# EAGLE design midi_block_R2_0 (EAGLE 6.6.0)
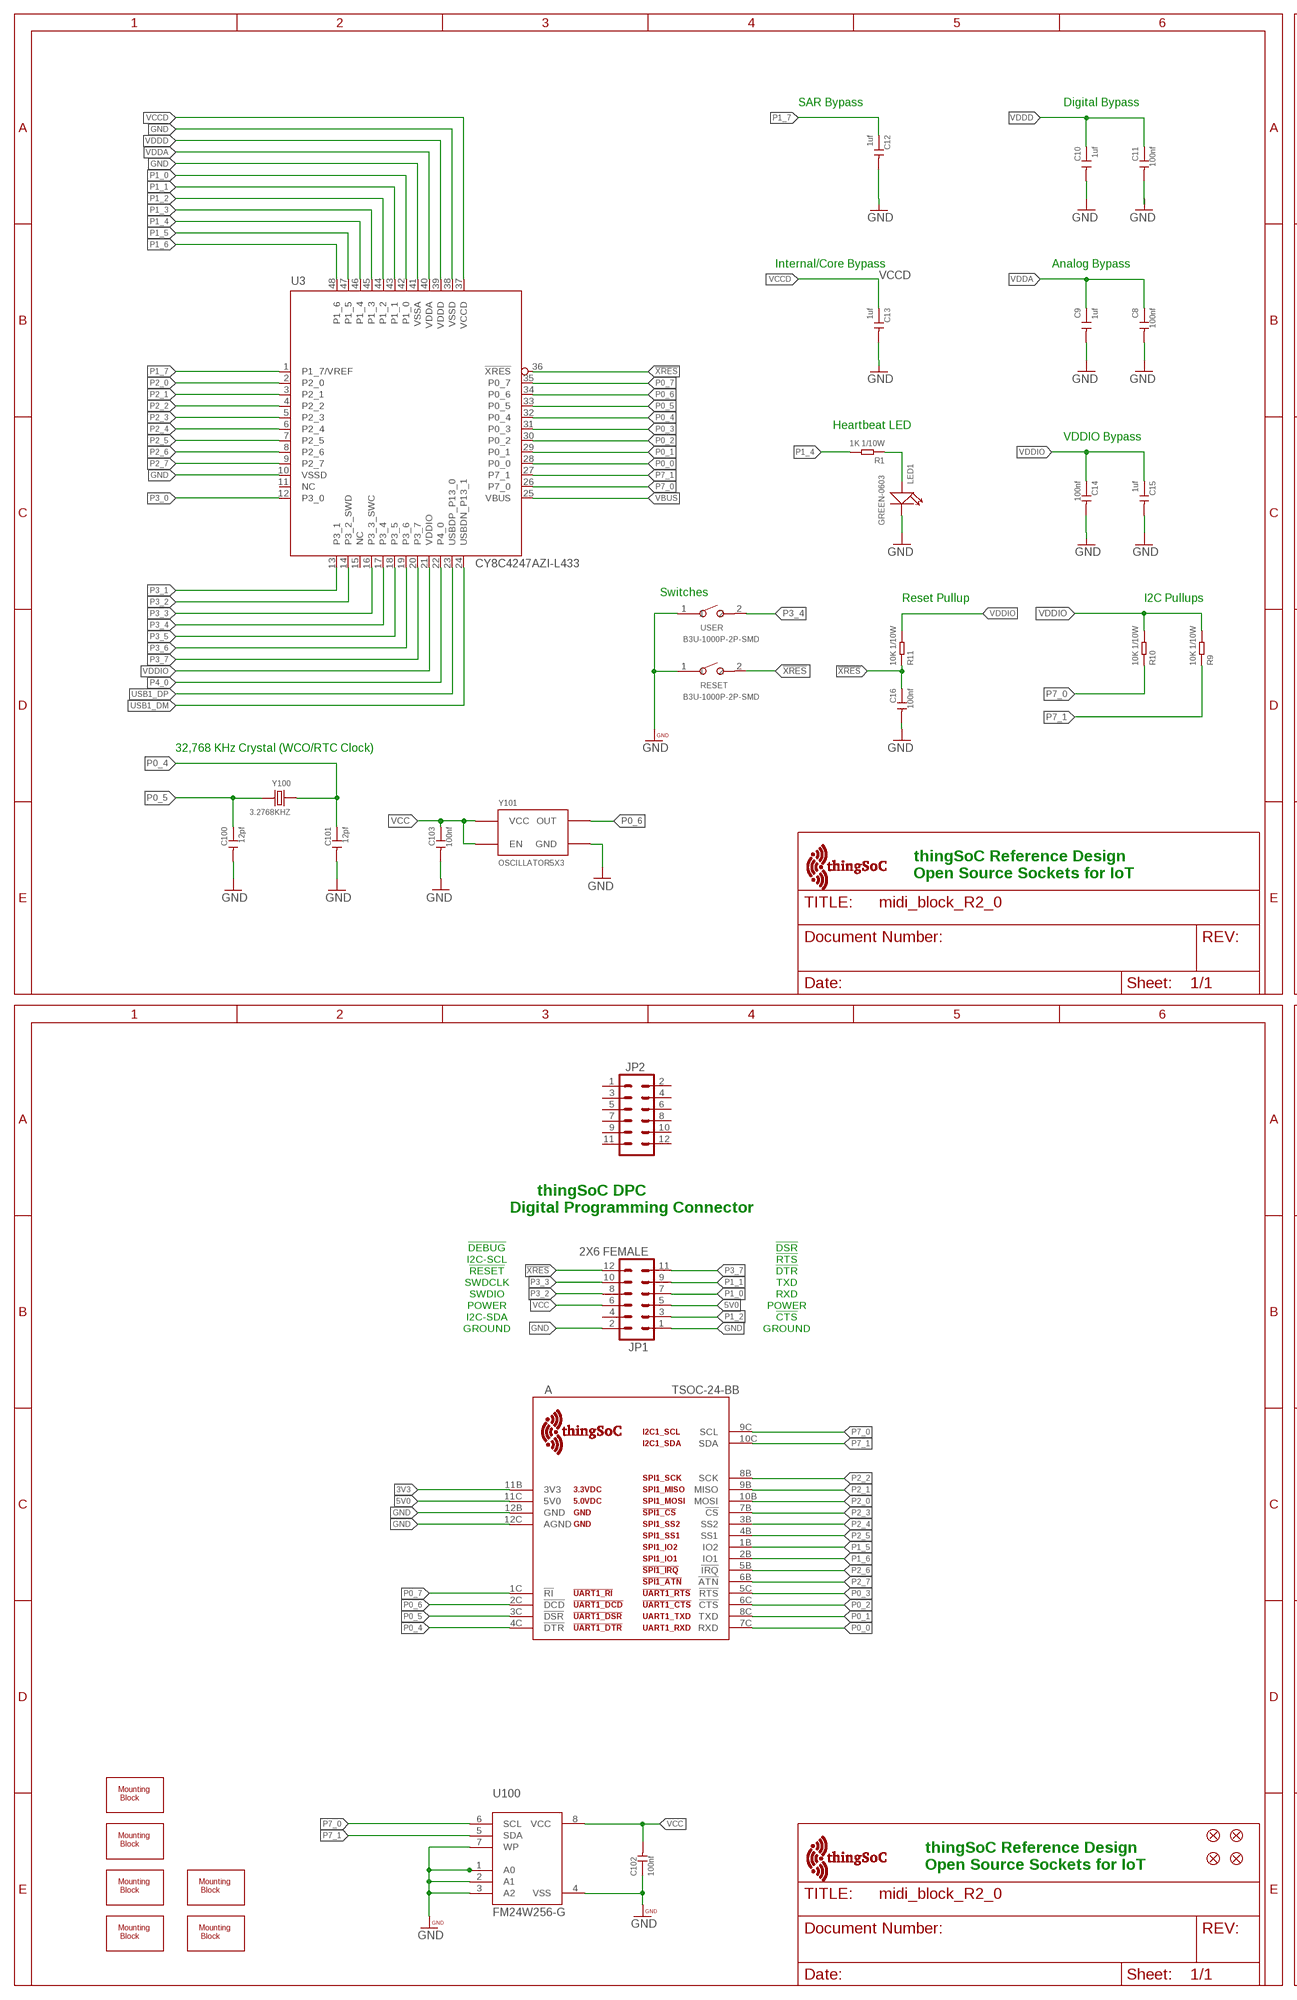
[diagram p0: schematic, sheet 1, part 1 of 2]
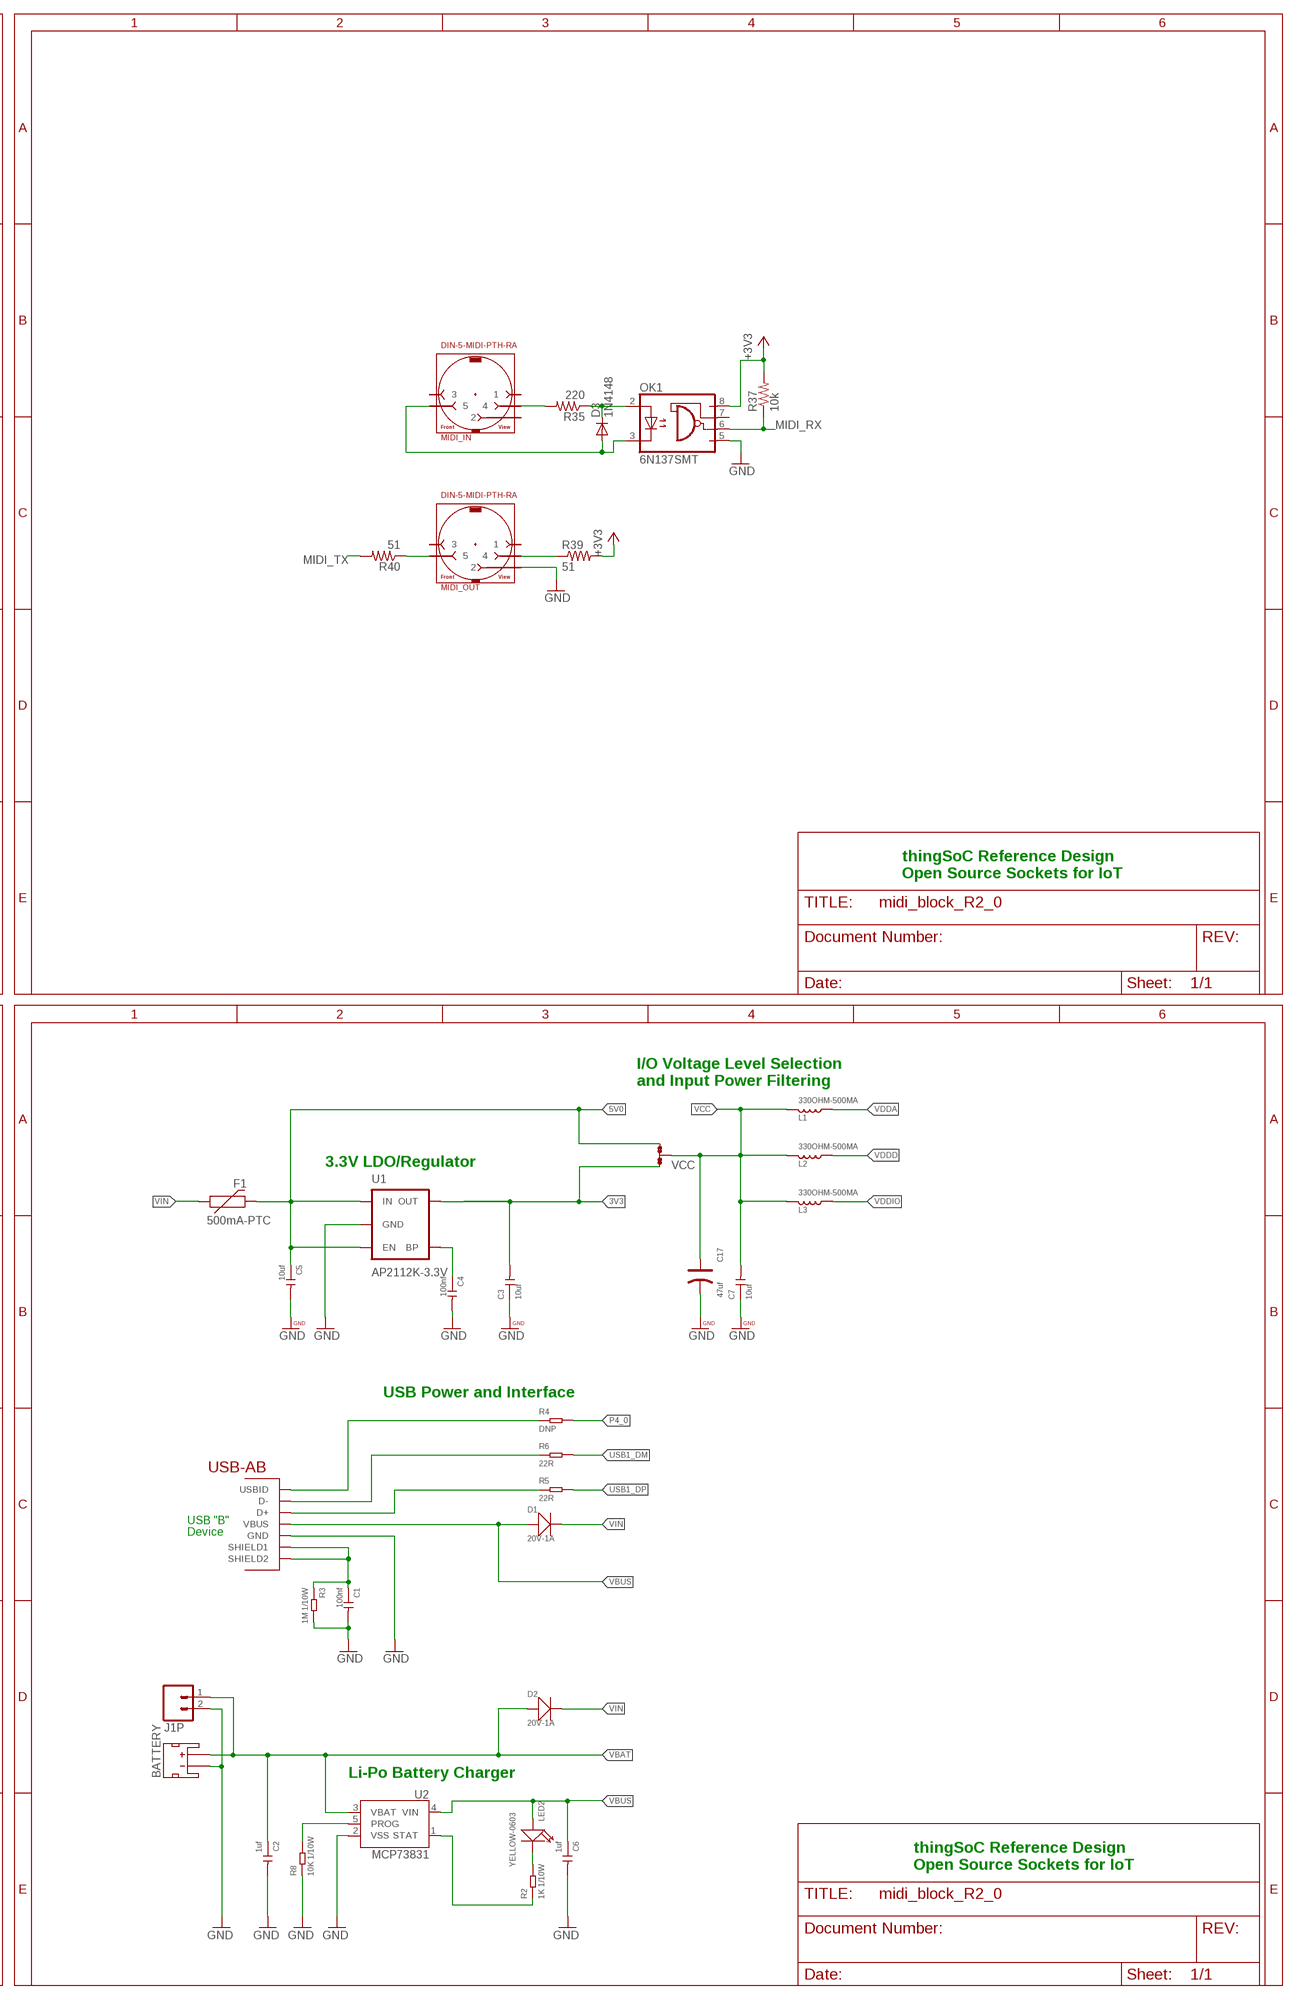
[diagram p1: schematic, sheet 1, part 2 of 2]

## Parts
A  TSOC-24-BB  [TSOC-BB-S24]
BATTERY  JST_2MM_MALE  [JST-2-SMD]
C1  100nf  CERAMIC-100NF-50V-10%-X7R(0603)  [C0603]
C2  1uf  CERAMIC-1UF-25V-10%-X7R(0603)  [C0603]
C3  10uf  CERAMIC-10UF-10V-10%-X5R(0603)  [C0603]
C4  100nf  CERAMIC-100NF-50V-10%-X7R(0603)  [C0603]
C5  10uf  CERAMIC-10UF-10V-10%-X5R(0603)  [C0603]
C6  1uf  CERAMIC-1UF-25V-10%-X7R(0603)  [C0603]
C7  10uf  CERAMIC-10UF-10V-10%-X5R(0603)  [C0603]
C8  100nf  CERAMIC-100NF-50V-10%-X7R(0603)  [C0603]
C9  1uf  CERAMIC-1UF-25V-10%-X7R(0603)  [C0603]
C10  1uf  CERAMIC-1UF-25V-10%-X7R(0603)  [C0603]
C11  100nf  CERAMIC-100NF-50V-10%-X7R(0603)  [C0603]
C12  1uf  CERAMIC-1UF-25V-10%-X7R(0603)  [C0603]
C13  1uf  CERAMIC-1UF-25V-10%-X7R(0603)  [C0603]
C14  100nf  CERAMIC-100NF-50V-10%-X7R(0603)  [C0603]
C15  1uf  CERAMIC-1UF-25V-10%-X7R(0603)  [C0603]
C16  100nf  CERAMIC-100NF-50V-10%-X7R(0603)  [C0603]
C17  47uf  TANTALUM-SMD-47UF-6.3V(AVX-A)  [AVX-A]
C100  12pf  CERAMIC-12PF-50V-5%-NPO(0603)  [C0603]
C101  12pf  CERAMIC-12PF-50V-5%-NPO(0603)  [C0603]
C102  100nf  CERAMIC-100NF-50V-10%-X7R(0603)  [C0603]
C103  100nf  CERAMIC-100NF-50V-10%-X7R(0603)  [C0603]
D1  20V-1A  SMD-DIODE-SCHOTTKY-20V-1A(SOD-123)  [SOD-123]
D2  20V-1A  SMD-DIODE-SCHOTTKY-20V-1A(SOD-123)  [SOD-123]
D3  1N4148  DIODE-SOD323-W  [SOD323-W]
F1  500mA-PTC  PTCSMD  [PTC-1206]
FID1  FIDUCIALUFIDUCIAL  [MICRO-FIDUCIAL]
FID2  FIDUCIALUFIDUCIAL  [MICRO-FIDUCIAL]
FID3  FIDUCIALUFIDUCIAL  [MICRO-FIDUCIAL]
FID4  FIDUCIALUFIDUCIAL  [MICRO-FIDUCIAL]
J1P  M02-JST-2-PTH-NO_SILK  [JST-2-PTH-NS]
JP1  2X6 FEMALE  M06X2PTH_FEMALE  [2X6]
JP2  M06X2FEMALE-SMT  [2X6_SMD]
L1  330OHM-500MA  SMD-FERRITE-CHIP-120-OHM-500MA(0603)  [L0603]
L2  330OHM-500MA  SMD-FERRITE-CHIP-120-OHM-500MA(0603)  [L0603]
L3  330OHM-500MA  SMD-FERRITE-CHIP-120-OHM-500MA(0603)  [L0603]
LED1  GREEN-0603  SMD-LED-CLEAR-GREEN(0603)  [LED-0603]
LED2  YELLOW-0603  SMD-LED-CLEAR-YELLOW(0603)  [LED-0603]
MIDI_IN  DIN-5-MIDI-PTH-RA  [DIN-5-PTH-RA-SUPPORT]
MIDI_OUT  DIN-5-MIDI-PTH-RA  [DIN-5-PTH-RA-SUPPORT]
OK1  6N137SMT  [DIL8-SMD]
R1  1K 1/10W  SMD-RES-1K-5%-1/10W(0603)  [R0603]
R2  1K 1/10W  SMD-RES-1K-5%-1/10W(0603)  [R0603]
R3  1M 1/10W  SMD-RES-1M-5%-1/10W(0603)  [R0603]
R4  DNP  SMD-RES-22R-5%-1/10W(0603)  [R0603]
R5  22R  SMD-RES-22R-5%-1/10W(0603)  [R0603]
R6  22R  SMD-RES-22R-5%-1/10W(0603)  [R0603]
R8  10K 1/10W  SMD-RES-10K-5%-1/10W(0603)  [R0603]
R9  10K 1/10W  SMD-RES-10K-5%-1/10W(0603)  [R0603]
R10  10K 1/10W  SMD-RES-10K-5%-1/10W(0603)  [R0603]
R11  10K 1/10W  SMD-RES-10K-5%-1/10W(0603)  [R0603]
R35  220  R-US_R0603  [R0603]
R37  10k  R-US_R0603  [R0603]
R39  51  R-US_R0603  [R0603]
R40  51  R-US_R0603  [R0603]
RESET  B3U-1000P-2P-SMD  SMD-BUTTON(2P-3.0X2.5X1.2+0.4MM)-B3U-1000P-2P-SMD  [SW2-2.6-3.0X2.5X1.2+0.4MM]
U1  AP2112K-3.3V  V_REG_LDOSMD  [SOT23-5]
U2  MCP73831  [SOT23-5]
U3  CY8C4247AZI-L433  [TQFP-7X7-48]
U100  FM24W256-G  [SO08]
U$1  PCB-MB-SIDE  [PCB-MB-01-SIDE]
U$7  PCB-MB-SIDE  [PCB-MB-01-SIDE]
U$8  PCB-MB-SIDE  [PCB-MB-01-SIDE]
U$9  PCB-MB-SIDE  [PCB-MB-01-SIDE]
U$10  PCB-MB-SIDE  [PCB-MB-01-SIDE]
U$11  PCB-MB-SIDE  [PCB-MB-01-SIDE]
U$100  TSOC-LOGO-LRG  [TSOC-LOGO-LRG]
U$101  TSOC-LOGO-SMALL  [TSOC-LOGO-SML]
USB  USB_AB  [USB-AB-MICRO-SMD]
USER  B3U-1000P-2P-SMD  SMD-BUTTON(2P-3.0X2.5X1.2+0.4MM)-B3U-1000P-2P-SMD  [SW2-2.6-3.0X2.5X1.2+0.4MM]
VCC  JMP-3-1_2  [JMP-3-1_2]
Y100  3.2768KHZ  SMD-CRYSTAL-32.768KHZ-12.5PF-20PPM-90K(2P-L2.0X1.2MM)  [X2-SMD-L2.0X1.2X0.55MM]
Y101  OSCILLATOR5X3  [CRYSTAL-SMD-5X3]

## Nets
3V3: A.11B(3V3) C3.2 U1.5(OUT) VCC.1
5V0: A.11C(5V0) C5.1 F1.2 JP1.5 U1.1(IN) U1.3(EN) VCC.3
!XRES: C16.1 JP1.12 R11.1 RESET.2 U3.36(!XRES)
+3V3: OK1.8(VCC) R37.2 R39.2
BYPASS1: C4.1 U1.4(BP)
CLED: LED2.- R2.2
CSTAT: R2.1 U2.1(STAT)
GND: A.12B(GND) A.12C(AGND) BATTERY.1(-) C1.2 C2.2 C3.1 C4.2 C5.2 C6.2 C7.1 C8.2 C9.2 C10.2 C11.2 C12.2 C13.2 C14.2 C15.2 C16.2 C17.- C100.2 C101.2 C102.1 C103.2 J1P.2 JP1.1 JP1.2 LED1.- MIDI_OUT.2 OK1.5(GND) R3.2 R8.1 RESET.1 U1.2(GND) U2.2(VSS) U3.10(VSSD) U3.38(VSSD) U3.41(VSSA) U100.1(A0) U100.2(A1) U100.3(A2) U100.4(VSS) U100.7(WP) USB.GND USER.1 Y101.2(GND)
MIDI_RX: OK1.6(VO) R37.1
MIDI_TX: R40.2
N$1: R8.2 U2.5(PROG)
N$8: D3.C OK1.2(A) R35.1
N$9: MIDI_IN.4 R35.2
N$10: MIDI_OUT.5 R40.1
N$12: D3.A MIDI_IN.5 OK1.3(C)
N$13: MIDI_OUT.4 R39.1
N$17: LED1.+ R1.1
P0_0: A.7C(RXD) U3.28(P0_0)
P0_1: A.8C(TXD) U3.29(P0_1)
P0_2: A.6C(!CTS) U3.30(P0_2)
P0_3: A.5C(!RTS) U3.31(P0_3)
P0_4: A.4C(!DTR) C101.1 U3.32(P0_4) Y100.1
P0_5: A.3C(!DSR) C100.1 U3.33(P0_5) Y100.2
P0_6: A.2C(!DCD) U3.34(P0_6) Y101.3(OUT)
P0_7: A.1C(!RI) U3.35(P0_7)
P1_0: JP1.7 U3.42(P1_0)
P1_1: JP1.9 U3.43(P1_1)
P1_2: JP1.3 U3.44(P1_2)
P1_3: U3.45(P1_3)
P1_4: R1.2 U3.46(P1_4)
P1_5: A.1B(IO2) U3.47(P1_5)
P1_6: A.2B(IO1) U3.48(P1_6)
P1_7: C12.1 U3.1(P1_7/VREF)
P2_0: A.10B(MOSI) U3.2(P2_0)
P2_1: A.9B(MISO) U3.3(P2_1)
P2_2: A.8B(SCK) U3.4(P2_2)
P2_3: A.7B(!CS) U3.5(P2_3)
P2_4: A.3B(SS2) U3.6(P2_4)
P2_5: A.4B(SS1) U3.7(P2_5)
P2_6: A.5B(!IRQ) U3.8(P2_6)
P2_7: A.6B(!ATN) U3.9(P2_7)
P3_0: U3.12(P3_0)
P3_1: U3.13(P3_1)
P3_2: JP1.8 U3.14(P3_2_SWD)
P3_3: JP1.10 U3.16(P3_3_SWC)
P3_4: U3.17(P3_4) USER.2
P3_5: U3.18(P3_5)
P3_6: U3.19(P3_6)
P3_7: JP1.11 U3.20(P3_7)
P4_0: R4.2 U3.22(P4_0)
P7_0: A.9C(SCL) R10.1 U3.26(P7_0) U100.6(SCL)
P7_1: A.10C(SDA) R9.1 U3.27(P7_1) U100.5(SDA)
USB1_DM: R6.2 U3.24(USBDN_P13_1)
USB1_DP: R5.2 U3.23(USBDP_P13_0)
USB1_I: R4.1 USB.ID(USBID)
USB1_M: R6.1 USB.D-
USB1_P: R5.1 USB.D+
USB1_SHIELD: C1.1 R3.1 USB.SHIELD1 USB.SHIELD2
VBAT: BATTERY.2(+) C2.1 D2.+ J1P.1 U2.3(VBAT)
VBUS: C6.1 D1.+ LED2.+ U2.4(VIN) U3.25(VBUS) USB.VBUS
VCC: C7.2 C17.+ C102.2 C103.1 JP1.6 L1.1 L2.1 L3.1 U100.8(VCC) VCC.2 Y101.1(EN) Y101.4(VCC)
VCCD: C13.1 U3.37(VCCD)
VDDA: C8.1 C9.1 L1.2 U3.40(VDDA)
VDDD: C10.1 C11.1 L2.2 U3.39(VDDD)
VDDIO: C14.1 C15.1 L3.2 R9.2 R10.2 R11.2 U3.21(VDDIO)
VIN: D1.- D2.- F1.1
Unconnected: BATTERY.NC1(PAD1) BATTERY.NC2(PAD2) JP1.4 JP2.1 JP2.2 JP2.3 JP2.4 JP2.5 JP2.6 JP2.7 JP2.8 JP2.9 JP2.10 JP2.11 JP2.12 MIDI_IN.1 MIDI_IN.2 MIDI_IN.3 MIDI_OUT.1 MIDI_OUT.3 OK1.7(VE) U3.11(NC) U3.15(NC)

## Notes on the sheet
- SAR Bypass | Digital Bypass
- Internal/Core Bypass | Analog Bypass
- Heartbeat LED
- VDDIO Bypass
- Switches
- Reset Pullup | I2C Pullups
- 32,768 KHz Crystal (WCO/RTC Clock)
- thingSoC Reference Design
  Open Source Sockets for IoT
- thingSoC Reference Design
  Open Source Sockets for IoT
- I/O Voltage Level Selection
  and Input Power Filtering
- 3.3V LDO/Regulator
- thingSoC DPC
  Digital Programming Connector
- !DEBUG | !DSR
- I2C-SCL | !RTS
- !RESET | !DTR
- SWDCLK | TXD
- SWDIO | RXD
- POWER | POWER
- I2C-SDA | !CTS
- GROUND | GROUND
- USB Power and Interface
- USB "B"
- Device
- Li-Po Battery Charger
- thingSoC Reference Design
  Open Source Sockets for IoT
- thingSoC Reference Design
  Open Source Sockets for IoT

## Library data of the parts
A = thingSoC:TSOC-24: thingSoC Twenty-Four(24) Pin Socket Source LBR : http://www.thingsoc.com Github : https://github.com/thingsoc License : http://creativecommons.org/licenses/by-sa/4.0/ (Creative Commons 4.0) THIS SOFTWARE IS PROVIDED BY THE CONTRIBUTORS "AS IS" AND WITHOUT ANY EXPRESS OR IMPLIED WARRANTIES, INCLUDING, BUT NOT LIMITED TO, THE IMPLIED WARRANTIES OF MERCHANTABILITY AND FITNESS FOR A PARTICULAR PURPOSE ARE DISCLAIMED. IN NO EVENT SHALL THE COPYRIGHT OWNER OR CONTRIBUTORS BE LIABLE FOR ANY DIRECT, INDIRECT, INCIDENTAL, SPECIAL, EXEMPLARY, OR CONSEQUENTIAL DAMAGES (INCLUDING, BUT NOT LIMITED TO, PROCUREMENT OF SUBSTITUTE GOODS OR SERVICES; LOSS OF USE, DATA, OR PROFITS; OR BUSINESS INTERRUPTION) HOWEVER CAUSED AND ON ANY THEORY OF LIABILITY, WHETHER IN CONTRACT, STRICT LIABILITY, OR TORT (INCLUDING NEGLIGENCE OR OTHERWISE) ARISING IN ANY WAY OUT OF THE USE OF THIS SOFTWARE, EVEN IF ADVISED OF THE POSSIBILITY OF SUCH DAMAGE.
BATTERY = TSOC-ESP8266-BASE:JST_2MM_MALE: Mates to single-cell LiPo batteries. CONN-11443 Now with smashable polarity marks!; BTM_NEG: -; BTM_POS: +; PROD_ID: CONN-11443; TOP_NEG: -; TOP_POS: +
C1 C4 C8 C11 C14 C16 C102 C103 = Seeed-Capacitor-2016:CERAMIC-100NF-50V-10%-X7R(0603): 302010138; MPN: CC0603KRX7R9BB104
C2 C6 C9 C10 C12 C13 C15 = Seeed-Capacitor-2016:CERAMIC-1UF-25V-10%-X7R(0603): 302010139; MPN: CC0603KRX7R8BB105
C3 C5 C7 = Seeed-Capacitor-2016:CERAMIC-10UF-10V-10%-X5R(0603): 302010103; MPN: CC0603KRX5R6BB106
C17 = Seeed-Capacitor-2016:TANTALUM-SMD-47UF-6.3V(AVX-A): 302020005; MPN: TAJA476*006#NJ
C100 C101 = Seeed-Capacitor-2016:CERAMIC-12PF-50V-5%-NPO(0603): 302010067; MPN: CC0603JRNPO9BN120
D1 D2 = Seeed-Diode-2016:SMD-DIODE-SCHOTTKY-20V-1A(SOD-123): 304020034; MPN: B5819W
D3 = diode:DIODE-: DIODE
F1 = SparkFun:PTC: Resettable Fuse PTC Resettable Fuse. Spark Fun Electronics SKU : COM-08357
FID1-FID4 = TSOC-ESP8266-BASE:FIDUCIAL: Fiducial Alignment Points Various fiducial points for machine vision alignment.
J1P = TSOC-ESP8266-BASE:M02: Standard 2-pin 0.1" header. Use with - straight break away headers ( PRT-00116) - right angle break away headers (PRT-00553) - swiss pins (PRT-00743) - machine pins (PRT-00117) - female headers (PRT-00115) Molex polarized connector foot print use with: PRT-08233 with associated crimp pins and housings. 2.54_SCREWTERM for use with PRT-10571. 3.5mm Screw Terminal footprints for PRT-08084 5mm Screw Terminal footprints for use with PRT-08432
JP1 = halcyonmod_Connectors:M06X2; PROD_ID: CONN-12423
JP2 = halcyonmod_Connectors:M06X2
L1-L3 = Seeed-Inductor-2016:SMD-FERRITE-CHIP-120-OHM-500MA(0603): 303030001; MPN: BLM18AG121SN1D; VALUE: 120OHM-500MA
LED1 = Seeed-LED-2016:SMD-LED-CLEAR-GREEN(0603): 304090043; MPN: 19-217-G7C-AN1P2-3T
LED2 = Seeed-LED-2016:SMD-LED-CLEAR-YELLOW(0603): 304090044; MPN: 19-217-Y5C-AM1N1VY-3T
MIDI_IN MIDI_OUT = oXo_connectors:DIN-5-MIDI: DIN-5 (MIDI) connector
OK1 = og-optocouplers:6N137: MOTOROLA OPTO COUPLER
R1 R2 = Seeed-Resistor-2016:SMD-RES-1K-5%-1/10W(0603): 301010291; MPN: RC0603JR-071KL
R3 = Seeed-Resistor-2016:SMD-RES-1M-5%-1/10W(0603): 301010100; MPN: RC0603JR-071ML
R4 = Seeed-Resistor-2016:SMD-RES-22R-5%-1/10W(0603): 301010289; MPN: RC0603JR-0722RL; VALUE: 22R
R5 R6 = Seeed-Resistor-2016:SMD-RES-22R-5%-1/10W(0603): 301010289; MPN: RC0603JR-0722RL
R8-R11 = Seeed-Resistor-2016:SMD-RES-10K-5%-1/10W(0603): 301010293; MPN: RC0603JR-0710KL
R35 R37 R39 R40 = rcl:R-US_: RESISTOR, American symbol
RESET USER = Seeed-Switch-2016:SMD-BUTTON(2P-3.0X2.5X1.2+0.4MM): 311020047; MPN: B3U-1000P-2P-SMD
U1 = SparkFun-PowerIC:V_REG_LDO: Voltage Regulator LDO Standard 150mA LDO voltage regulator in SOT-23 layout. Micrel part MIC5205. BP (by-pass) pin is used to lower output noise with 470pF cap.; PROD_ID: VREG-12457
U2 = TSOC-ESP8266-BASE:MCP73831: Miniature single cell, fully integrated Li-Ion, Li-polymer charge management controller http://ww1.microchip.com/downloads/en/DeviceDoc/20001984g.pdf IC-09995; PROD_ID: IC-09995
U3 = PatternAgents-Cypress:CY8C4247AZI-L433: Cypress PSoC® 4 - Programmable System on Chip, Cortex-M0 Based : USB Version! http://www.cypress.com/?mpn=CY8C4247AZI-L433 LBR Source: http://www.patternagents.com THIS SOFTWARE IS PROVIDED BY THE CONTRIBUTORS "AS IS" AND WITHOUT ANY EXPRESS OR IMPLIED WARRANTIES, INCLUDING, BUT NOT LIMITED TO, THE IMPLIED WARRANTIES OF MERCHANTABILITY AND FITNESS FOR A PARTICULAR PURPOSE ARE DISCLAIMED. IN NO EVENT SHALL THE COPYRIGHT OWNER OR CONTRIBUTORS BE LIABLE FOR ANY DIRECT, INDIRECT, INCIDENTAL, SPECIAL, EXEMPLARY, OR CONSEQUENTIAL DAMAGES (INCLUDING, BUT NOT LIMITED TO, PROCUREMENT OF SUBSTITUTE GOODS OR SERVICES; LOSS OF USE, DATA, OR PROFITS; OR BUSINESS INTERRUPTION) HOWEVER CAUSED AND ON ANY THEORY OF LIABILITY, WHETHER IN CONTRACT, STRICT LIABILITY, OR TORT (INCLUDING NEGLIGENCE OR OTHERWISE) ARISING IN ANY WAY OUT OF THE USE OF THIS SOFTWARE, EVEN IF ADVISED OF THE POSSIBILITY OF SUCH DAMAGE.
U100 = PatternAgents-Cypress:FM24W256: I2C FRAM FM24W256
U$1 U$7-U$11 = halcyonmod_Hardware:PCB-MB: Mounting Block Hardware Attaches two PCB's at a Right Angle using #4 Self-Threading Screws Source: http://www.essentracomponents.com.sg/images-line/pdfs/PCB-MB.pdf
U$100 U$101 = thingSoC:TSOC-LOGO: thingSoC Logo Source LBR : http://www.thingsoc.com Github : https://github.com/thingsoc License : http://creativecommons.org/licenses/by-sa/4.0/ (Creative Commons 4.0) THIS SOFTWARE IS PROVIDED BY THE CONTRIBUTORS "AS IS" AND WITHOUT ANY EXPRESS OR IMPLIED WARRANTIES, INCLUDING, BUT NOT LIMITED TO, THE IMPLIED WARRANTIES OF MERCHANTABILITY AND FITNESS FOR A PARTICULAR PURPOSE ARE DISCLAIMED. IN NO EVENT SHALL THE COPYRIGHT OWNER OR CONTRIBUTORS BE LIABLE FOR ANY DIRECT, INDIRECT, INCIDENTAL, SPECIAL, EXEMPLARY, OR CONSEQUENTIAL DAMAGES (INCLUDING, BUT NOT LIMITED TO, PROCUREMENT OF SUBSTITUTE GOODS OR SERVICES; LOSS OF USE, DATA, OR PROFITS; OR BUSINESS INTERRUPTION) HOWEVER CAUSED AND ON ANY THEORY OF LIABILITY, WHETHER IN CONTRACT, STRICT LIABILITY, OR TORT (INCLUDING NEGLIGENCE OR OTHERWISE) ARISING IN ANY WAY OUT OF THE USE OF THIS SOFTWARE, EVEN IF ADVISED OF THE POSSIBILITY OF SUCH DAMAGE.
USB = BeeSafe:USB_AB: This is a USB AB connector that is compatible with USB OTG. i.e. this connector can serve as a host or device
VCC = PatternAgents-ProtoPads:JMP-3-1_2: Three Terminal Jumper - 1 & 2 Connected Positions 1and 2 are normally connected. PatternAgents ProtoPads Library Schematic and PCB layout libraries for design patterns by PatternAgents. For the CADSoft Eagle CAD program : http://www.cadsoftusa.com/download-eagle/ Source LBR : http://www.patternagents.com Github : https://github.com/PatternAgents License : http://creativecommons.org/licenses/by-sa/4.0/ (Creative Commons 4.0) THIS SOFTWARE IS PROVIDED BY THE CONTRIBUTORS "AS IS" AND WITHOUT ANY EXPRESS OR IMPLIED WARRANTIES, INCLUDING, BUT NOT LIMITED TO, THE IMPLIED WARRANTIES OF MERCHANTABILITY AND FITNESS FOR A PARTICULAR PURPOSE ARE DISCLAIMED. IN NO EVENT SHALL THE COPYRIGHT OWNER OR CONTRIBUTORS BE LIABLE FOR ANY DIRECT, INDIRECT, INCIDENTAL, SPECIAL, EXEMPLARY, OR CONSEQUENTIAL DAMAGES (INCLUDING, BUT NOT LIMITED TO, PROCUREMENT OF SUBSTITUTE GOODS OR SERVICES; LOSS OF USE, DATA, OR PROFITS; OR BUSINESS INTERRUPTION) HOWEVER CAUSED AND ON ANY THEORY OF LIABILITY, WHETHER IN CONTRACT, STRICT LIABILITY, OR TORT (INCLUDING NEGLIGENCE OR OTHERWISE) ARISING IN ANY WAY OUT OF THE USE OF THIS SOFTWARE, EVEN IF ADVISED OF THE POSSIBILITY OF SUCH DAMAGE.; BOM: EXCLUDE
Y100 = Seeed-Crystal Oscillator-2016:SMD-CRYSTAL-32.768KHZ-12.5PF-20PPM-90K(2P-L2.0X1.2MM): 306010020; MPN: FC-12M
Y101 = SparkFun-FreqCtrl:OSCILLATOR: Generic 5x3 and 7x5 oscillators

## Net classes
1 vcc: width 0.254 mm

## Board
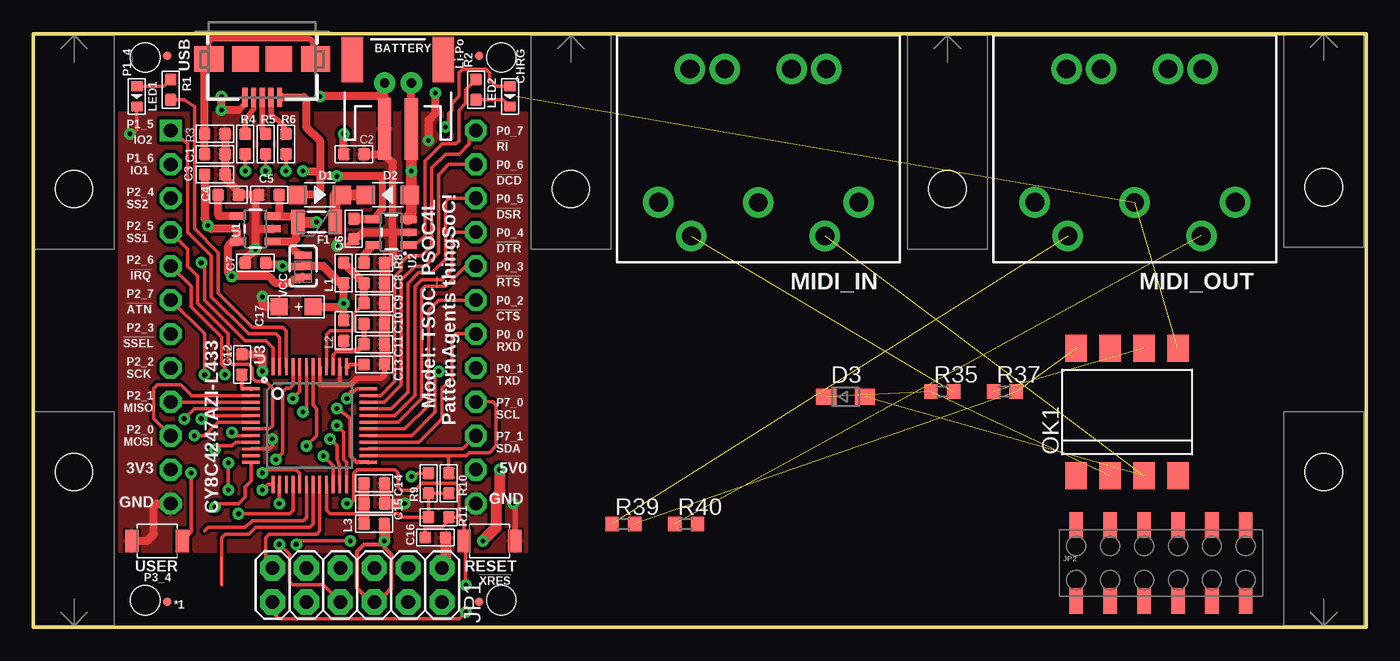
[diagram p2: board, top side]
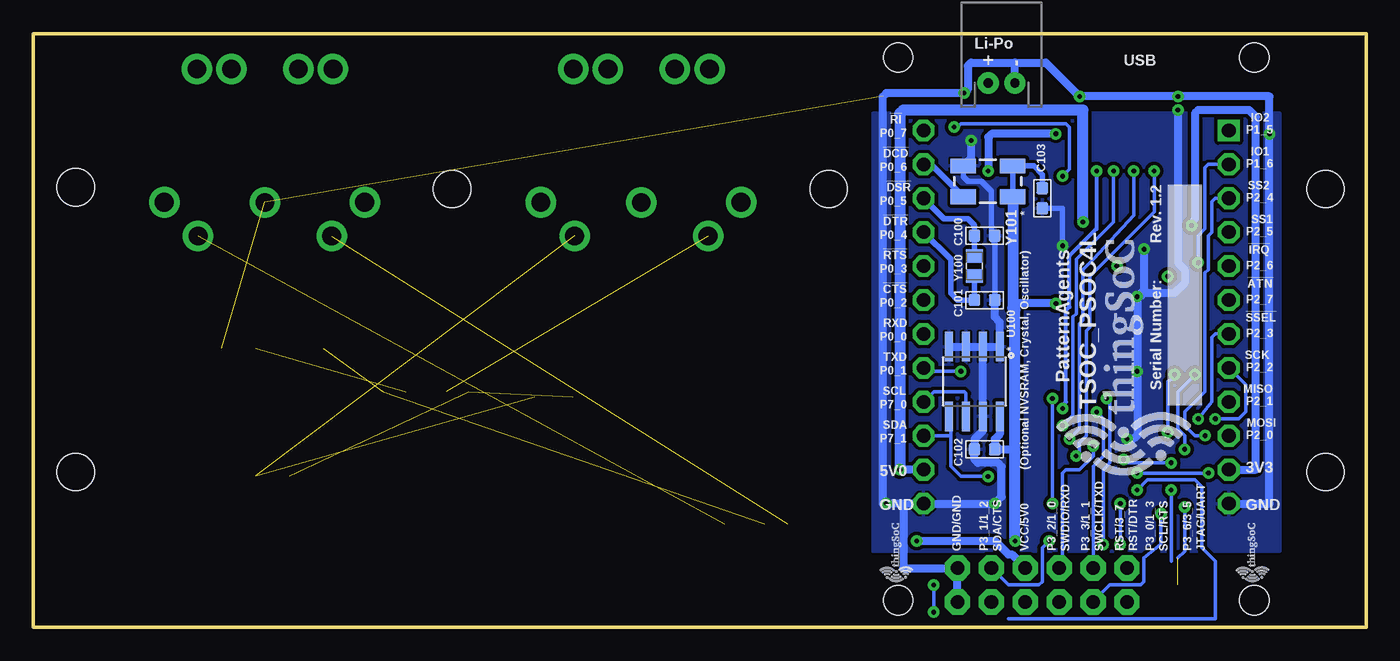
[diagram p3: board, bottom side, seen from below]

Size 99.82 x 44.45 mm. Coordinates in mm from the lower left corner, seen from the top.
Outline: 0,0 0,44.45 99.82,44.45 99.82,0 0,0
Copper layers (1*16): Top 0.035mm / dielectric 1.5mm / Bottom 0.035mm
Design rules "PatternAgents_7mil": minimum track width 7mil, minimum drill 14mil, track to track 7mil, track to pad 7mil, pad to pad 7mil, via to via 7mil, smd to smd 7mil, copper to edge 7mil, drill to drill 7mil, minimum pad ring 12mil, minimum via ring 10mil, stop-mask expansion 4mil, vias tented up to drill 25mil, thermal gap 7mil
Holes 2.2 mm at 8.38,2.03 35.05,2.03 35.05,42.67 8.38,42.67

### Footprints (pad centres in the part's own frame; a part is rotated, then mirrored left to right if it is on the bottom)
TSOC-BB-S24 = drill 1.016 square: 1B -11.43,11.43 | drill 1.016 octagon: 1C 11.43,11.43; 2B -11.43,8.89; 2C 11.43,8.89; 3B -11.43,6.35; 3C 11.43,6.35; 4B -11.43,3.81; 4C 11.43,3.81; 5B -11.43,1.27; 5C 11.43,1.27; 6B -11.43,-1.27; 6C 11.43,-1.27; 7B -11.43,-3.81; 7C 11.43,-3.81; 8B -11.43,-6.35; 8C 11.43,-6.35; 9B -11.43,-8.89; 9C 11.43,-8.89; 10B -11.43,-11.43; 10C 11.43,-11.43; 11B -11.43,-13.97; 11C 11.43,-13.97; 12B -11.43,-16.51; 12C 11.43,-16.51
JST-2-SMD = smd 1 x 4.6: 1 -1,-3.7; 2 1,-3.7 | smd 1.6 x 3.4: NC1 -3.4,1.5; NC2 3.4,1.5
C0603 = smd 0.889 x 0.889: 1 0,0.762; 2 0,-0.762
AVX-A = smd 1.27 x 1.27: + -1.27,0; - 1.27,0
SOD-123 = smd 1.397 x 1.397: + -1.651,0; - 1.651,0
SOD323-W = smd 1.5 x 1.2: A 1.45,0; C -1.45,0
PTC-1206 = smd 1 x 1.8: 1 -1.4,0; 2 1.4,0
MICRO-FIDUCIAL = smd 0.635 x 0.635: 1 0,0
JST-2-PTH-NS = drill 0.7 pad 1.6: 1 -1,0; 2 1,0
2X6 = drill 1.016 pad 1.88 octagon: 1 0,0; 2 0,2.54; 3 2.54,0; 4 2.54,2.54; 5 5.08,0; 6 5.08,2.54; 7 7.62,0; 8 7.62,2.54; 9 10.16,0; 10 10.16,2.54; 11 12.7,0; 12 12.7,2.54
2X6_SMD = smd 1.02 x 1.9: 1 -5.08,-2.85; 2 -5.08,2.85; 3 -2.54,-2.85; 4 -2.54,2.85; 5 0,-2.85; 6 0,2.85; 7 2.54,-2.85; 8 2.54,2.85; 9 5.08,-2.85; 10 5.08,2.85; 11 7.62,-2.85; 12 7.62,2.85
L0603 = smd 0.889 x 0.889: 1 -0.762,0; 2 0.762,0
LED-0603 = smd 0.762 x 0.889: + -0.762,0; - 0.762,0
DIN-5-PTH-RA-SUPPORT = drill 1.4 pad 2.286: 1 7.54,3.6; 2 0.06,3.61; 3 -7.47,3.6; 4 5.07,6.13; 5 -4.93,6.12; SR1 -5.03,-6.382; SR2 -2.43,-6.382; SR3 2.57,-6.382; SR4 5.178,-6.382
DIL8-SMD = smd 1.6 x 2: 1 -3.81,-4.77; 2 -1.27,-4.77; 3 1.27,-4.77; 4 3.81,-4.77; 5 3.81,4.77; 6 1.27,4.77; 7 -1.27,4.77; 8 -3.81,4.77
R0603 = smd 0.889 x 0.889: 1 0,0.762; 2 0,-0.762
R0603' = smd 1 x 1.1: 1 -0.85,0; 2 0.85,0
SW2-2.6-3.0X2.5X1.2+0.4MM = smd 1 x 1.7: 1 -1.9,0; 2 1.9,0
SOT23-5 = smd 0.55 x 1.2: 1 -0.95,-1.3; 2 0,-1.3; 3 0.95,-1.3; 4 0.95,1.3; 5 -0.95,1.3
TQFP-7X7-48 = smd 1.3 x 0.21: 1 -4.4,2.75; 2 -4.4,2.25; 3 -4.4,1.75; 4 -4.4,1.25; 5 -4.4,0.75; 6 -4.4,0.25; 7 -4.4,-0.25; 8 -4.4,-0.75; 9 -4.4,-1.25; 10 -4.4,-1.75; 11 -4.4,-2.25; 12 -4.4,-2.75; 25 4.4,-2.75; 26 4.4,-2.25; 27 4.4,-1.75; 28 4.4,-1.25; 29 4.4,-0.75; 30 4.4,-0.25; 31 4.4,0.25; 32 4.4,0.75; 33 4.4,1.25; 34 4.4,1.75; 35 4.4,2.25; 36 4.4,2.75 | smd 0.21 x 1.3: 13 -2.75,-4.4; 14 -2.25,-4.4; 15 -1.75,-4.4; 16 -1.25,-4.4; 17 -0.75,-4.4; 18 -0.25,-4.4; 19 0.25,-4.4; 20 0.75,-4.4; 21 1.25,-4.4; 22 1.75,-4.4; 23 2.25,-4.4; 24 2.75,-4.4; 37 2.75,4.4; 38 2.25,4.4; 39 1.75,4.4; 40 1.25,4.4; 41 0.75,4.4; 42 0.25,4.4; 43 -0.25,4.4; 44 -0.75,4.4; 45 -1.25,4.4; 46 -1.75,4.4; 47 -2.25,4.4; 48 -2.75,4.4
SO08 = smd 0.61 x 2.21: 1 -1.905,-2.616; 2 -0.635,-2.616; 3 0.635,-2.616; 4 1.905,-2.616; 5 1.905,2.616; 6 0.635,2.616; 7 -0.635,2.616; 8 -1.905,2.616
PCB-MB-01-SIDE = hole 2.8: 3.5,0
USB-AB-MICRO-SMD = smd 1.4 x 0.4: D+ 2.85,0; D- 2.85,0.65; GND 2.85,-1.3; ID 2.85,-0.65; VBUS 2.85,1.3 | smd 1.9 x 2: P$6 0,1.25; P$7 0,-1.25 | smd 1.9 x 2.2: SHIELD1 0,4; SHIELD2 0,-4
JMP-3-1_2 = smd 0.508 x 1.27: 1 -0.813,0; 2 0,0; 3 0.813,0
X2-SMD-L2.0X1.2X0.55MM = smd 1 x 1.25: 1 -0.75,0; 2 0.75,0
CRYSTAL-SMD-5X3 = smd 1.9 x 1.1: 1 -1.85,-1.15; 2 1.85,-1.15; 3 1.85,1.15; 4 -1.85,1.15

### Placement (x,y rotation side)
A  21.72,25.78 0 top
BATTERY  27.3,41.02 0 top
C1  13.59,35.43 90 top
C2  24,35.43 90 top
C3  13.59,33.91 270 top
C4  14.61,32.38 90 top
C5  17.65,32.38 270 top
C6  24,29.84 0 top
C7  16.64,27.3 90 top
C8  25.53,25.78 90 top
C9  25.53,24.26 90 top
C10  25.53,22.73 90 top
C11  25.53,21.21 90 top
C12  15.62,19.68 180 top
C13  25.53,19.68 90 top
C14  25.53,10.79 90 top
C15  25.53,9.27 90 top
C16  30.1,6.73 90 top
C17  19.68,24 180 top
C100  28.57,29.34 90 bottom
C101  28.57,24.51 90 bottom
C102  28.57,13.34 90 bottom
C103  24.26,32.13 0 bottom
D1  21.46,32.38 0 top
D2  26.54,32.38 180 top
D3  60.83,17.27 0 top
F1  21.21,30.35 180 top
FID1  10.03,42.8 90 top
FID2  33.4,42.8 90 top
FID3  10.03,1.91 90 top
FID4  33.4,1.91 90 top
J1P  27.3,40.77 0 bottom
JP1  30.61,4.45 180 top
JP2  83.19,4.83 0 top
L1  23.24,26.54 90 top
L2  23.24,22.23 270 top
L3  25.53,7.75 180 top
LED1  7.75,39.75 270 top
LED2  35.69,39.75 270 top
MIDI_IN  54.36,35.43 180 top
MIDI_OUT  82.55,35.43 180 top
OK1  81.92,16.13 0 top
R1  10.29,40.26 0 top
R2  33.15,40.26 0 top
R3  13.59,36.96 90 top
R4  15.88,36.2 0 top
R5  17.4,36.2 0 top
R6  18.92,36.2 0 top
R8  25.53,27.3 270 top
R9  29.59,10.79 0 top
R10  31.11,10.79 0 top
R11  30.35,8.26 270 top
R35  220  [R0603']  68.07,17.65 0 top
R37  10k  [R0603']  72.77,17.65 0 top
R39  51  [R0603']  44.2,7.75 0 top
R40  51  [R0603']  48.9,7.75 0 top
RESET  34.16,6.48 180 top
U1  16.64,29.84 90 top
U2  26.8,29.59 90 top
U3  20.7,15.11 0 top
U100  29.34,18.41 180 bottom
U$1  96.65,36.45 270 top
U$7  3.05,36.32 270 top
U$8  40.26,36.32 270 top
U$9  68.45,36.32 270 top
U$10  3.05,8.13 90 top
U$11  96.65,8.13 90 top
U$100  18.16,14.61 90 bottom
U$101  8.51,4.19 90 bottom
U$102  TSOC-LOGO-SMALL  [TSOC-LOGO-SML]  35.18,4.19 90 bottom
USB  17.14,42.55 270 top
USER  9.27,6.48 0 top
VCC  20.19,27.05 90 top
Y100  29.34,27.05 90 bottom
Y101  28.32,33.4 180 bottom

### Tracks (layer width: path | path; a pad name or v marks a point on that pad's centre or on a via)
3V3  (via drill 0.36)
  Top 0.61: 15.27,28.83 15.27,29.69 15.11,29.84 13.34,29.84 v13.08,30.1 12.83,30.61 C3.2 | 15.27,28.83 14.86,28.83 14.61,28.57 14.61,26.54 v14.86,26.29 17.65,26.29 18.16,25.78 19.18,25.78 19.43,26.04 19.94,26.04 20.14,26.24 VCC.1 | 15.27,28.83 U1.5
  Bottom 0.61: A.11B 8.26,11.81 8.26,38.23 8.76,38.73 12.57,38.73 12.83,38.48 12.83,30.61 v13.08,30.1
5V0  (via drill 0.36)
  Top 0.61: C5.1 18.41,30.82 U1.3 19.62,30.8 F1.2 19.68,30.74 19.68,29.08 19.5,28.89 | U1.1 19.5,28.89 | VCC.3 19.89,27.86 19.43,28.32 19.43,28.83 19.5,28.89
  Top 0.813: F1.2 v21.21,30.35 | v34.92,11.81 34.92,10.03 34.67,9.78 34.67,7.49 v33.66,6.48
  Bottom 0.61: A.11C v34.92,11.81 | v33.66,6.48 27.81,6.48 26.8,5.46 26.54,5.46 JP1.5
  Bottom 0.813: v21.21,30.35 21.21,38.73 34.67,38.73 34.92,38.48 v34.92,11.81
!XRES  (via drill 0.36)
  Top 0.254: U3.36 24.21,17.86 24,17.65 23.75,17.65 v23.5,17.14 | C16.1 29.34,7.49 30.61,7.49 30.86,7.75 R11.1 31.88,8.26 | 31.88,8.26 32.26,7.87 RESET.2 32.38,6.36 v32.38,3.17 | JP1.12 17.91,1.14 18.41,0.64 31.88,0.64 v32.38,1.14 | v23.5,9.27 23.75,9.27 24,9.53 24,11.56 24.26,11.81 27.05,11.81 27.3,11.56 27.3,10.54 27.56,10.29 28.57,10.29 29.08,10.79 31.62,10.79 31.88,10.54 31.88,8.26
  Bottom 0.254: v23.5,17.14 v23.5,9.27 | v32.38,3.17 v32.38,1.14
+3V3  (2 unrouted)
BYPASS1
  Top 0.61: U1.4 13.91,30.8 13.84,30.86 C4.1
CLED
  Top 0.254: R2.2 35.18,39.5 LED2.-
CSTAT
  Top 0.254: U2.1 28.16,28.57 28.83,28.83 29.34,29.34 29.34,34.92 30.61,36.2 31.62,36.2 31.88,36.45 31.88,38.73 32.38,39.24 32.38,40.26 R2.1
GND  (via drill 0.36)  (2 unrouted)
  Top 0.254: LED1.- 7.75,37.21 v7.24,36.96 | U3.10 17.68,13.36 17.91,13.59 v17.91,14.1
  Top 0.305: U3.38 22.95,18.2 22.99,18.16 | U3.41 21.45,18.17 21.46,18.16
  Top 0.406: USB.GND 15.85,39.21 15.37,38.73 | C13.2 26.29,18.92 26.04,18.67 24.26,18.67 23.75,18.16 22.99,18.16 21.46,18.16 | RESET.1 36.06,9.15 v35.94,9.27 | v22.73,28.57 23.5,28.57 C6.2
  Top 0.508: U2.2 26.92,29.59 26.92,34.42
  Top 0.61: 15.37,38.73 v14.1,38.73 v14.1,39.75 | R3.2 C1.2 C3.1 14.35,33.66 15.11,32.89 C4.2 C5.2 16.64,32.13 16.64,29.84 | 26.29,35.43 26.29,37.3 BATTERY.1 26.29,37.34 26.29,39.75 | C2.2 26.29,35.43 | R8.1 26.8,27.3 26.92,27.69 26.92,29.59 24.77,29.59 C6.2 | 26.29,39.75 v21.46,39.75 | 26.29,39.75 26.29,40.75 J1P.2 | 16.64,29.84 U1.2 | USER.1 8.51,6.48 9.02,6.99 9.02,9.02 9.27,9.27 A.12B | 26.92,34.42 26.92,34.8 26.29,35.43 | 16.64,29.84 v16.64,28.32 15.88,27.56 C7.1 | C12.2 16.89,20.45 17.14,20.19 v17.14,19.18 | v30.1,40.01 30.1,38.48 29.59,37.97 v29.59,36.45 | C17.- 17.4,24 17.14,24.26 v17.14,24.77
  Top 0.813: R8.1 C8.2 C9.2 C10.2 C11.2 C13.2 | C14.2 C15.2 v27.81,9.27 | C16.2 30.86,4.7 JP1.1
  Bottom 0.406: C101.2 27.81,28.83 | 27.81,28.83 C100.2 | Y101.2 30.17,33.73 29.84,33.4 28.83,33.4 28.07,32.64 28.07,29.08 27.81,28.83 | C103.2 22.73,31.37 v22.73,28.57
  Bottom 0.61: 34.67,9.27 v35.94,9.27 36.2,9.27 36.2,39.75 35.94,40.01 v30.1,40.01 29.84,40.26 29.84,42.04 29.59,42.29 26.29,42.29 | 26.29,42.29 24,42.29 v21.46,39.75 v14.1,39.75 7.24,39.75 v7.24,36.96 7.24,9.27 A.12B | v14.1,38.73 14.1,27.3 13.59,26.8 13.59,25.78 14.35,25.02 16.38,25.02 | 16.38,25.02 16.64,25.02 | 16.64,25.02 16.89,25.02 v17.14,24.77 | v17.14,24.77 v17.14,19.18 17.14,14.38 17.4,14.12 17.88,14.12 v17.91,14.1 | v29.59,36.45 29.59,35.13 Y101.2 | U100.4 U100.3 U100.2 | U100.2 U100.7 28.7,14.73 29.34,14.1 C102.1 29.34,12.57 29.08,12.32 27.56,12.32 27.3,12.06 27.3,9.78 v27.81,9.27 A.12C 34.67,9.27 | U100.2 U100.1 27.43,22.86 27.81,23.24 C101.2 | v16.64,28.32 16.64,25.27 16.38,25.02 | JP1.2 JP1.1 34.67,4.45 34.67,9.27 | J1P.2 26.3,42.27 26.29,42.29 | v17.14,24.77 16.89,24.77 16.64,25.02
  pour Top (isolate 0.254, hatched): 36.96,5.71 6.48,5.71 6.48,38.48 36.96,38.48
  pour Bottom (isolate 0.254, hatched): 36.96,5.71 6.48,5.71 6.48,38.48 36.96,38.48
MIDI_RX  (1 unrouted)
N$1
  Top 0.61: R8.2 24.77,27.85 U2.5
N$8  (2 unrouted)
N$9  (1 unrouted)
N$10  (1 unrouted)
N$12  (2 unrouted)
N$13  (1 unrouted)
N$17
  Top 0.254: LED1.+ 9.78,40.51 R1.1
P0_0
  Top 0.254: U3.28 28.85,13.86 30.61,15.62 30.61,17.91 31.37,18.67 31.37,21.72 31.62,21.97 A.7C
P0_1  (via drill 0.36)
  Top 0.254: U3.29 28.33,14.36 30.1,16.13 30.1,19.18 v30.35,19.18
  Bottom 0.254: v30.35,19.18 32.89,19.18 A.8C
P0_2
  Top 0.254: U3.30 27.82,14.86 29.59,16.64 29.59,23.75 30.35,24.51 A.6C
P0_3
  Top 0.254: A.5C 32.38,27.05 30.86,25.53 29.34,25.53 29.08,25.27 29.08,17.14 27.3,15.36 U3.31
P0_4
  Top 0.254: U3.32 27.04,15.86 28.57,17.4 28.57,25.53 29.08,26.04 30.61,26.04 31.37,26.8 31.37,29.34 31.62,29.59 A.4C
  Bottom 0.406: A.4C 31.11,27.56 31.11,25.02 30.61,24.51 C101.1 Y100.1
P0_5
  Top 0.254: A.3C 31.11,32.13 30.86,31.88 30.86,27.56 29.84,26.54 28.83,26.54 28.07,25.78 28.07,17.65 26.78,16.36 U3.33
  Bottom 0.406: C100.1 Y100.2 29.34,30.1 29.84,30.61 31.62,30.61 A.3C
P0_6
  Top 0.254: A.2C 31.11,34.67 30.35,33.91 30.35,28.07 29.34,27.05 28.57,27.05 27.56,26.04 27.56,18.16 26.26,16.86 U3.34
  Bottom 0.406: A.2C 32.59,34.67 Y101.3
P0_7
  Top 0.254: U3.35 26,17.36 27.05,18.41 27.05,26.29 27.56,26.8 27.56,27.3 28.07,27.81 29.08,27.81 29.84,28.57 29.84,34.42 30.86,35.43 31.88,35.43 32.64,36.2 32.64,36.7 A.1C
P1_0  (via drill 0.36)
  Top 0.254: U3.42 20.95,16.64 21.21,16.38 21.21,14.35 v20.45,13.59
  Bottom 0.254: v20.45,13.59 20.45,12.83 21.46,11.81 22.48,11.81 22.73,11.56 22.73,4.7 JP1.7
P1_1  (via drill 0.36)
  Top 0.254: U3.43 20.45,16.39 v20.19,16.13
  Bottom 0.254: JP1.9 20.45,12.06 19.68,12.83 19.68,15.62 v20.19,16.13
P1_2  (via drill 0.36)
  Top 0.254: U3.44 19.95,17.66 v19.43,17.14 | v23.75,6.48 19.94,6.48 v19.68,6.22
  Bottom 0.254: JP1.3 26.8,3.17 24.51,3.17 24.26,3.43 24.26,5.97 v23.75,6.48 | v19.68,6.22 19.68,11.81 19.18,12.32 19.18,16.89 v19.43,17.14
P1_3  (via drill 0.36)
  Top 0.254: v14.61,10.29 v14.61,12.32 | U3.45 19.45,18.18 19.18,17.91 18.92,17.91 18.67,17.65 18.67,13.08 v18.16,12.57
  Bottom 0.254: v14.61,12.32 17.91,12.32 v18.16,12.57 | v14.61,10.29 14.61,4.95
P1_4
  Top 0.254: R1.2 11.3,39.5 12.06,38.99 12.06,29.84 13.84,28.07 13.84,25.02 16.38,22.48 18.67,22.48 18.95,22.2 U3.46
P1_5
  Top 0.254: A.1B 11.56,36.2 11.56,29.59 13.34,27.81 13.34,24.77 16.13,21.97 18.16,21.97 18.45,21.68 U3.47
P1_6  (via drill 0.36)
  Top 0.254: v12.57,27.3 12.83,27.3 12.83,24.51 15.88,21.46 17.4,21.46 17.95,20.91 U3.48
  Bottom 0.254: v12.57,27.3 12.57,29.34 12.06,29.84 12.06,34.42 11.81,34.67 A.2B
P1_7
  Top 0.305: U3.1 15.66,17.86 15.62,17.91 C12.1
P2_0
  Top 0.254: U3.2 11.85,17.36 11.05,18.16 9.27,18.16 9.02,17.91 9.02,15.62 A.10B
P2_1
  Top 0.254: U3.3 10.31,16.86 A.9B
P2_2  (via drill 0.36)
  Top 0.254: U3.4 12.04,16.36 v11.3,15.62
  Bottom 0.254: v11.3,15.62 9.53,15.62 9.02,16.13 9.02,18.16 A.8B
P2_3  (via drill 0.36)
  Top 0.254: U3.5 13.07,15.86 v12.57,15.62
  Bottom 0.254: v12.57,15.62 11.56,16.89 11.56,21.72 11.3,21.97 A.7B
P2_4  (via drill 0.36)
  Top 0.254: U3.6 13.84,15.36 12.83,14.35 v12.06,14.35
  Bottom 0.254: v12.06,14.35 12.83,14.35 13.59,15.11 13.59,16.13 12.06,17.65 12.06,26.54 11.81,26.8 11.81,29.34 11.56,29.59 11.56,31.88 11.3,32.13 A.3B
P2_5
  Top 0.254: A.4B 11.56,28.32 11.56,27.05 12.32,26.29 12.32,24.26 14.61,21.97 14.61,19.94 14.86,19.68 16.13,19.68 16.38,19.43 16.38,18.67 16.64,18.41 17.4,18.41 17.91,17.91 17.91,15.11 17.65,14.86 U3.7
P2_6  (via drill 0.36)
  Top 0.254: U3.8 15.1,14.36 v14.86,14.61 | v14.35,18.92 14.35,19.43 14.1,19.68 14.1,21.72 11.81,24 11.81,25.53 A.5B
  Bottom 0.254: v14.35,18.92 14.35,18.67 14.86,18.41 v14.86,14.61
P2_7  (via drill 0.36)
  Top 0.254: U3.9 15.13,13.86 14.86,13.59 13.84,13.59 v13.59,13.34 | v12.83,18.92 12.83,21.97 A.6B
  Bottom 0.254: v13.59,13.34 13.59,14.35 14.1,14.86 14.1,17.65 v12.83,18.92
P3_0  (via drill 0.36)  (1 unrouted)
  Top 0.254: U3.12 16.3,10.97 15.88,10.54 15.88,9.78 15.37,9.27 13.84,9.27 v13.59,9.02
  Bottom 0.254: 14.1,5.21 13.59,5.71 v13.59,9.02
P3_1  (via drill 0.36)
  Top 0.254: U3.13 17.57,10.71 v17.14,10.29
  Bottom 0.254: 26.8,0.64 11.3,0.64 11.3,4.95 12.32,5.97 12.32,10.54 12.83,11.05 16.38,11.05 v17.14,10.29
P3_2  (via drill 0.36)
  Top 0.254: v18.41,9.27 18.41,10.68 U3.14 | JP1.8 21.72,3.17 19.43,3.17 19.18,3.43 19.18,5.46 v18.41,6.22
  Bottom 0.254: v18.41,6.22 v18.41,9.27
P3_3  (via drill 0.36)
  Top 0.254: U3.16 19.45,8.78 19.18,8.51 v15.37,8.51
  Bottom 0.254: JP1.10 19.18,3.17 16.89,3.17 16.64,3.43 16.64,5.21 15.37,6.22 v15.37,8.51
P3_4  (via drill 0.36)
  Top 0.254: U3.17 19.95,11.54 19.68,11.81 17.4,11.81 v17.14,11.56 | v11.81,11.56 11.81,7.12 USER.2
  Bottom 0.254: v17.14,11.56 v11.81,11.56
P3_5
  Top 0.254: U3.18 20.45,8.26 20.19,8 16.38,8 15.88,7.49 13.08,7.49 12.83,7.24
P3_6
  Top 0.254: U3.19 20.95,7.74 20.7,7.49 16.64,7.49 16.13,6.99 14.35,6.99 14.1,6.73 14.1,3.17
P3_7
  Top 0.254: U3.20 21.45,7.23 21.21,6.99 17.65,6.99 17.4,6.73 17.4,4.95 JP1.11
P4_0  (via drill 0.36)
  Top 0.254: R4.2 v15.88,34.16 | U3.22 22.45,12.09 v21.72,12.83
  Bottom 0.254: v15.88,34.16 15.88,31.11 20.7,26.29 20.7,22.48 20.95,22.23 20.95,14.35 21.46,13.84 21.46,13.08 v21.72,12.83
P7_0
  Top 0.254: U3.26 31.11,12.86 | 31.11,12.86 32.42,12.86 32.64,13.08 34.16,13.08 34.67,13.59 34.67,16.64 34.42,16.89 A.9C | R10.1 31.11,12.86
  Bottom 0.254: U100.6 29.97,17.53 30.1,17.65 32.38,17.65 A.9C
P7_1  (via drill 0.36)
  Top 0.254: U3.27 32.16,13.36 A.10C | R9.1 28.83,11.56 v28.32,11.3
  Bottom 0.254: A.10C 31.11,14.35 | 31.11,14.35 31.11,12.06 30.35,11.3 v28.32,11.3 | 31.11,14.35 31.11,15.67 U100.5
USB1_DM  (via drill 0.36)
  Top 0.254: R6.2 v18.92,34.16 | U3.24 23.45,12.36 23.24,12.57 23.24,14.61 v22.73,15.11
  Bottom 0.254: v18.92,34.16 18.92,30.35 21.72,27.56 21.72,23.5 21.97,23.24 21.97,15.88 v22.73,15.11
USB1_DP  (via drill 0.36)
  Top 0.254: R5.2 v17.4,34.16 | v22.23,14.1 22.73,13.59 22.73,12.57 22.95,12.1 U3.23
  Bottom 0.254: v17.4,34.16 17.4,30.86 20.45,27.56 21.21,26.8 21.21,22.99 21.46,22.73 21.46,14.86 v22.23,14.1
USB1_I
  Top 0.406: USB.ID 16.5,38.85 15.88,37.97 R4.1
USB1_M
  Top 0.406: USB.D- 17.8,38.34 18.67,37.72 R6.1
USB1_P
  Top 0.406: USB.D+ 17.14,37.21 R5.1
USB1_SHIELD
  Top 0.406: USB.SHIELD2 13.14,43.88 13.34,44.07 20.7,44.07 20.95,43.81 20.95,42.73
  Top 0.61: C1.1 R3.1 12.83,42.23 USB.SHIELD2 12.57,41.97 | 20.95,42.73 USB.SHIELD1
VBAT  (via drill 0.36)
  Top 0.61: C2.1 v23.24,36.96 | BATTERY.2 J1P.1
  Top 0.813: BATTERY.2 v28.3,34.16 28.3,33 D2.+ 28.32,32.26 28.32,31.11 28,30.54 U2.3
  Bottom 0.61: v23.24,36.96 28.05,36.96 28.3,36.7 v28.3,34.16
VBUS  (via drill 0.36)
  Top 0.178: USB.VBUS 18.39,39.6 18.67,39.7
  Top 0.254: LED2.+ 34.67,40.51 34.16,41.02 34.16,41.53 33.91,41.78 32.13,41.78 31.88,41.53 31.88,39.75 31.37,39.24 31.37,38.73 31.11,38.48 31.11,37.72 v30.86,37.47
  Top 0.305: U3.25 24.21,12.36 23.75,12.83 23.75,15.62 v22.73,16.38
  Top 0.508: U2.4 25.5,30.58 26.16,31.37 26.16,33.78
  Top 0.61: 18.67,39.7 20.25,39.7 20.45,39.5 20.45,37.47 21.46,36.45 21.46,34.16 | D1.+ 21.21,32.38 21.46,32.64 21.46,33.91 | 21.46,34.16 21.46,33.91 | 26.16,33.78 v22.73,33.78 21.59,33.78 21.46,33.91 | U2.4 24.19,30.54 C6.1 | v20.19,34.16 21.46,34.16
  Bottom 0.254: v30.86,37.47 30.61,37.47 30.35,37.72 22.48,37.72 22.23,37.47 22.23,34.29 v22.73,33.78
  Bottom 0.305: v20.19,34.16 20.19,29.84 22.23,27.81 22.23,24 22.48,23.75 22.48,16.89 22.73,16.64 v22.73,16.38
VCC  (via drill 0.36)
  Top 0.178: 17.5,27.15 C7.2 | 18.39,27.15 v18.67,27.05
  Top 0.305: JP1.6 25.27,1.91 24.26,2.92 24.26,5.71 24.77,6.22 26.04,6.22 v26.29,6.48 26.29,5.97 26.8,5.46 26.8,2.92 26.29,2.41 26.04,2.41 JP1.6
  Top 0.61: v18.67,27.05 VCC.2 21.72,27.05 22.99,25.78 L1.1 v23.24,24.26 | L2.1 v23.24,24.26 | 18.39,27.15 17.5,27.15 | C17.+ 22.99,24 v23.24,24.26
  Top 0.813: L3.1 v26.29,6.48
  Bottom 0.406: Y101.4 Y101.1 24.9,34.55 24.26,33.91 C103.1 | 26.47,23.93 26.29,23.75
  Bottom 0.61: v23.24,24.26 26.29,24.26 | U100.8 27.43,14.48 27.81,14.1 C102.2 26.54,13.34 26.29,13.08
  Bottom 0.813: v26.29,6.48 26.29,13.08 26.29,23.75 26.29,24.26 | Y101.4 26.47,23.93
VCCD
  Top 0.305: U3.37 23.58,19.51 23.75,19.68 C13.1
VDDA
  Top 0.254: U3.40 21.95,21.95 22.23,22.23 24,22.23 24,23.5 C9.1
  Top 0.61: C9.1 C8.1 L1.2
VDDD
  Top 0.254: U3.39 22.45,20.42 22.73,20.7
  Top 0.406: C10.1 C11.1 24.26,20.7 23.24,20.7 | 22.73,20.7 23.24,20.7 | L2.2 23.24,20.7
VDDIO
  Top 0.254: R10.2 R9.2 R11.2 27.56,8.26 27.3,8.51 24.77,8.51 | U3.21 21.95,8.78 22.23,8.51 24.51,8.51 24.77,8.26
  Top 0.813: L3.2 24.77,8.26 24.77,8.51 C15.1 C14.1
VIN
  Top 0.813: F1.1 22.61,32.39 D1.- D2.-

### Text on the board
tPlace: Li-Po | P1_4 | CHRG | P1_5 | P0_7 | IO2 | !RI | P1_6 | P0_6 | IO1 | P2_4 | !DCD | P0_5 | SS2 | !DSR | P2_5 | P0_4 | SS1 | P2_6 | !DTR | P0_3 | !IRQ | !RTS | P2_7 | P0_2 | !ATN | P2_3 | !CTS | P0_0 | !SSEL | RXD | P2_2 | P0_1 | SCK | P2_1 | TXD | P7_0 | MISO | Model: TSOC_PSOC4L | SCL | P2_0 | PatternAgents thingSoC! | P7_1 | MOSI | SDA | 3V3 | 5V0 | GND | GND | CY8C4247AZI-L433 | P3_4 | !XRES | *1
bPlace: Li-Po | USB | - | + | IO2 | !RI | P1_5 | P0_7 | IO1 | !DCD | P1_6 | P0_6 | SS2 | Rev. 1.2 | !DSR | P2_4 | P0_5 | SS1 | * | TSOC_PSOC4L | !DTR | !IRQ | P2_5 | P0_4 | PatternAgents | !RTS | P2_6 | P0_3 | !ATN | Serial Number: | !CTS | P2_7 | P0_2 | !SSEL | P2_3 | RXD | SCK | * | P0_0 | TXD | P2_2 | P0_1 | MISO | P2_1 | SCL | MOSI | P7_0 | SDA | P2_0 | P7_1 | 3V3 | (Optional NVSRAM, Crystal, Oscillator) | 5V0 | GND | GND | JTAG/UART | P3_6/3_5 | SCL/RTS | P3_0/1_3 | RST/DTR | RST/3_7 | SWCLK/TXD | P3_3/1_1 | SWDIO/RXD | P3_2/1_0 | VCC/5V0 | SDA/CTS | P3_1/1_2 | GND/GND